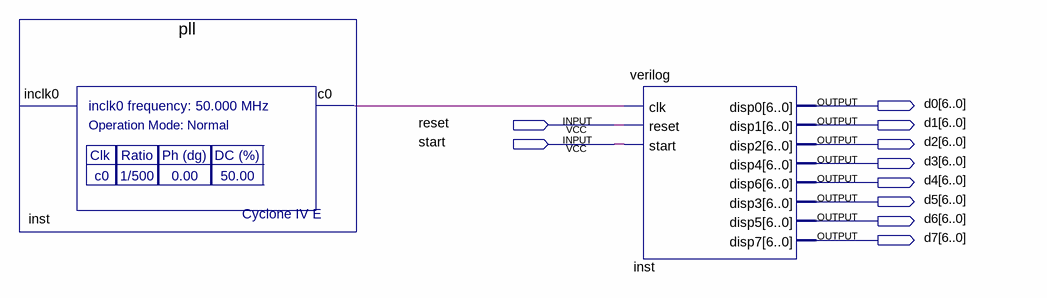
[diagram p0: schematic sheet]
// Quartus schematic Block1.bdf as structural Verilog: 2 symbols, 10 pins
module Block1 (
  input  reset,
  input  start,
  output [6:0] d0,
  output [6:0] d1,
  output [6:0] d2,
  output [6:0] d3,
  output [6:0] d4,
  output [6:0] d5,
  output [6:0] d6,
  output [6:0] d7
);

  wire inst_c0;

  pll inst (.c0(inst_c0));  // open: inclk0
  verilog inst_dup2 (
    .clk(inst_c0), .reset(reset), .start(start), .disp0(d0), .disp1(d1), .disp2(d2), .disp4(d3), .disp6(d4),
    .disp3(d5), .disp5(d6), .disp7(d7));
endmodule
